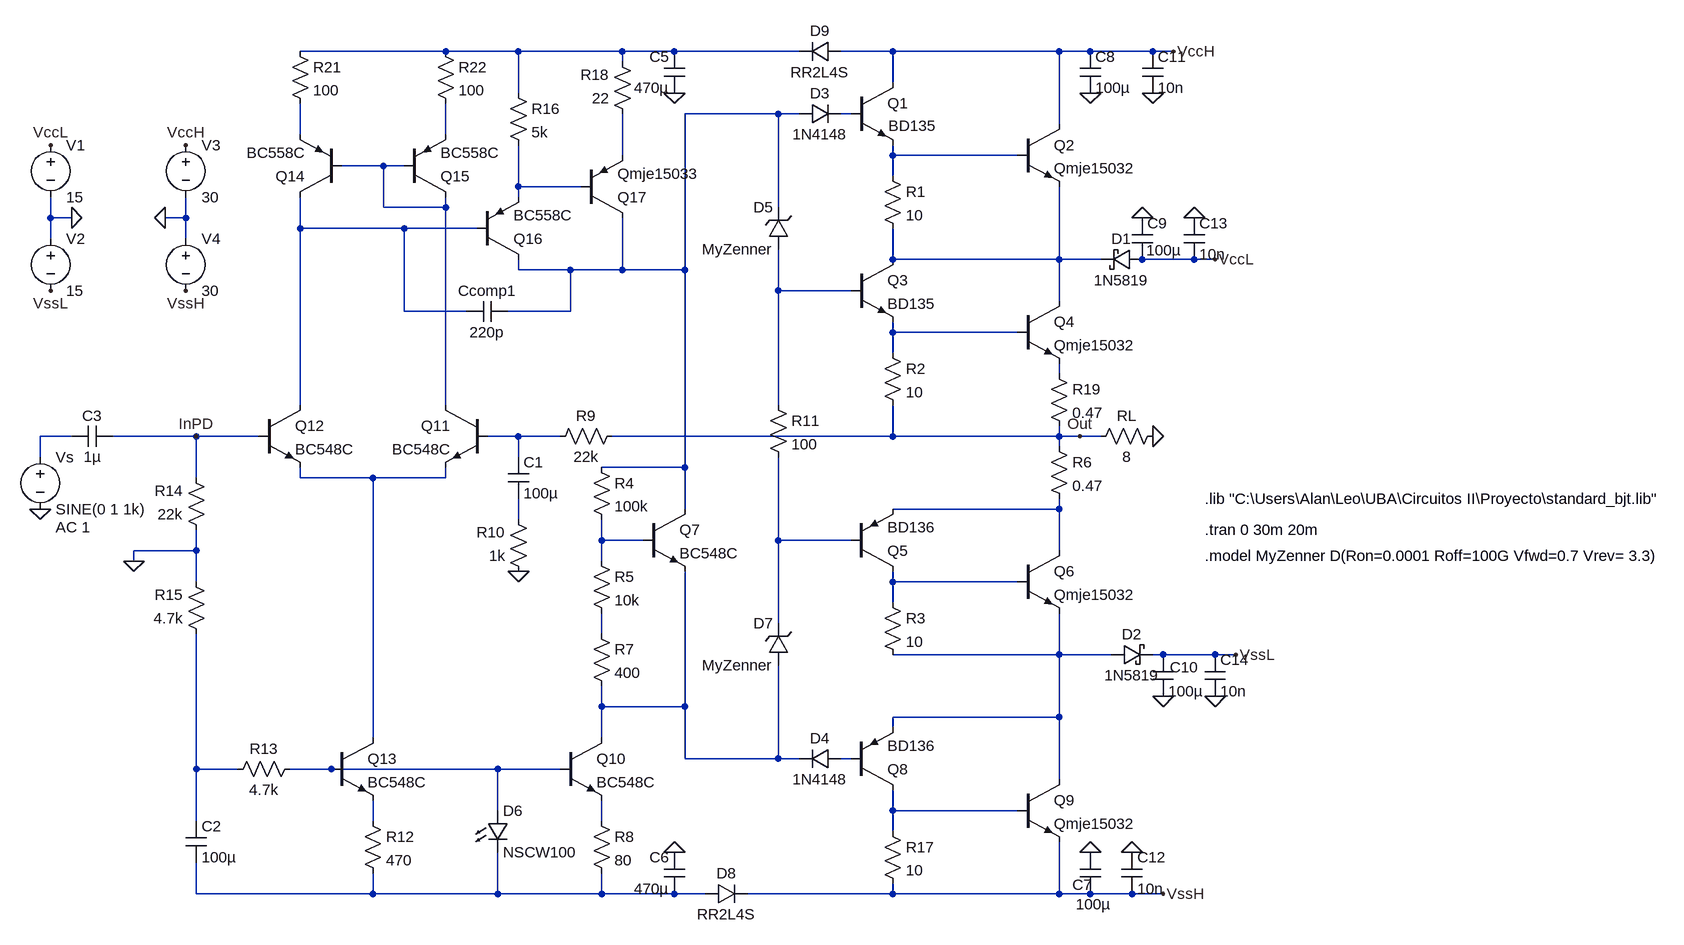
[diagram p0: schematic etapa_ampli_Sziklai (1).asc]
etapa_ampli_Sziklai (1).asc, the LTspice schematic file:
Version 4
SHEET 1 1736 1408
WIRE -512 48 -736 48
WIRE -400 48 -512 48
WIRE -240 48 -400 48
WIRE -160 48 -240 48
WIRE 32 48 -160 48
WIRE 176 48 96 48
WIRE 432 48 176 48
WIRE 480 48 432 48
WIRE 576 48 480 48
WIRE 608 48 576 48
WIRE -240 64 -240 48
WIRE 176 96 176 48
WIRE -400 112 -400 48
WIRE 0 144 -144 144
WIRE 32 144 0 144
WIRE 112 144 96 144
WIRE 432 160 432 48
WIRE -736 176 -736 128
WIRE -512 176 -512 128
WIRE -240 208 -240 144
WIRE 176 208 176 192
WIRE 368 208 176 208
WIRE -608 224 -672 224
WIRE -576 224 -608 224
WIRE 176 240 176 208
WIRE -400 256 -400 192
WIRE -304 256 -400 256
WIRE -400 272 -400 256
WIRE -608 288 -608 224
WIRE -512 288 -512 272
WIRE -512 288 -608 288
WIRE 0 288 0 144
WIRE -1120 304 -1120 272
WIRE -1088 304 -1120 304
WIRE -912 304 -912 272
WIRE -912 304 -944 304
WIRE -736 320 -736 272
WIRE -576 320 -736 320
WIRE -464 320 -576 320
WIRE -1120 336 -1120 304
WIRE -912 336 -912 304
WIRE 176 368 176 320
WIRE 432 368 432 256
WIRE 432 368 176 368
WIRE 496 368 432 368
WIRE 640 368 560 368
WIRE 672 368 640 368
WIRE -400 384 -400 368
WIRE -320 384 -400 384
WIRE -240 384 -240 304
WIRE -240 384 -320 384
WIRE -144 384 -144 144
WIRE -144 384 -240 384
WIRE 0 416 0 352
WIRE 112 416 0 416
WIRE 432 432 432 368
WIRE -576 448 -576 320
WIRE -480 448 -576 448
WIRE -320 448 -320 384
WIRE -320 448 -416 448
WIRE 176 480 176 464
WIRE 368 480 176 480
WIRE 176 512 176 480
WIRE 432 544 432 528
WIRE -736 592 -736 320
WIRE -512 592 -512 288
WIRE 0 592 0 416
WIRE -1088 640 -1136 640
WIRE -896 640 -1024 640
WIRE -800 640 -896 640
WIRE -400 640 -448 640
WIRE -336 640 -400 640
WIRE 176 640 176 592
WIRE 176 640 -256 640
WIRE 432 640 432 624
WIRE 432 640 176 640
WIRE 464 640 432 640
WIRE 496 640 464 640
WIRE 432 656 432 640
WIRE -1136 672 -1136 640
WIRE -400 672 -400 640
WIRE -144 688 -144 384
WIRE -144 688 -272 688
WIRE -896 704 -896 640
WIRE -736 704 -736 688
WIRE -624 704 -736 704
WIRE -512 704 -512 688
WIRE -512 704 -624 704
WIRE -144 752 -144 688
WIRE 432 752 432 736
WIRE 432 752 176 752
WIRE -400 768 -400 736
WIRE -272 800 -272 768
WIRE -208 800 -272 800
WIRE 0 800 0 672
WIRE 112 800 0 800
WIRE -896 816 -896 784
WIRE -896 816 -992 816
WIRE 432 816 432 752
WIRE -992 832 -992 816
WIRE -272 832 -272 800
WIRE -896 864 -896 816
WIRE 176 864 176 848
WIRE 368 864 176 864
WIRE 176 896 176 864
WIRE 0 928 0 800
WIRE -272 944 -272 912
WIRE 432 976 432 912
WIRE 432 976 176 976
WIRE 512 976 432 976
WIRE 592 976 576 976
WIRE 672 976 592 976
WIRE 704 976 672 976
WIRE -272 1056 -272 1024
WIRE -144 1056 -144 848
WIRE -144 1056 -272 1056
WIRE 432 1072 432 976
WIRE 432 1072 176 1072
WIRE 176 1088 176 1072
WIRE -624 1104 -624 704
WIRE -272 1104 -272 1056
WIRE -144 1136 -144 1056
WIRE 0 1136 0 992
WIRE 0 1136 -144 1136
WIRE 32 1136 0 1136
WIRE 112 1136 96 1136
WIRE -896 1152 -896 944
WIRE -832 1152 -896 1152
WIRE -688 1152 -752 1152
WIRE -432 1152 -688 1152
WIRE -336 1152 -432 1152
WIRE 432 1168 432 1072
WIRE -432 1216 -432 1152
WIRE 176 1216 176 1184
WIRE 368 1216 176 1216
WIRE -896 1232 -896 1152
WIRE -624 1232 -624 1200
WIRE -272 1232 -272 1200
WIRE 176 1248 176 1216
WIRE -896 1344 -896 1296
WIRE -624 1344 -624 1312
WIRE -624 1344 -896 1344
WIRE -432 1344 -432 1280
WIRE -432 1344 -624 1344
WIRE -272 1344 -272 1312
WIRE -272 1344 -432 1344
WIRE -160 1344 -272 1344
WIRE -112 1344 -160 1344
WIRE 176 1344 176 1328
WIRE 176 1344 -48 1344
WIRE 432 1344 432 1264
WIRE 432 1344 176 1344
WIRE 480 1344 432 1344
WIRE 544 1344 480 1344
WIRE 592 1344 544 1344
FLAG 672 368 VccL
FLAG 608 48 VccH
FLAG 576 640 0
FLAG 592 1344 VssH
FLAG -1088 304 0
FLAG -944 304 0
FLAG -912 192 VccH
FLAG -1120 192 VccL
FLAG -912 416 VssH
FLAG -1120 416 VssL
FLAG 464 640 Out
FLAG -400 848 0
FLAG -992 832 0
FLAG -1136 752 0
FLAG 704 976 VssL
FLAG -896 640 InPD
FLAG -160 112 0
FLAG -160 1280 0
FLAG 592 1040 0
FLAG 480 1280 0
FLAG 560 304 0
FLAG 480 112 0
FLAG 576 112 0
FLAG 544 1280 0
FLAG 640 304 0
FLAG 672 1040 0
DATAFLAG -144 736 "$-V(N025)"
SYMBOL npn 112 96 R0
WINDOW 3 57 66 Left 2
SYMATTR Value BD135
SYMATTR InstName Q1
SYMBOL npn 368 160 R0
SYMATTR InstName Q2
SYMATTR Value Qmje15032
SYMBOL npn 112 368 R0
SYMATTR InstName Q3
SYMATTR Value BD135
SYMBOL npn 368 432 R0
SYMATTR InstName Q4
SYMATTR Value Qmje15032
SYMBOL res 160 224 R0
SYMATTR InstName R1
SYMATTR Value 10
SYMBOL res 480 656 R270
WINDOW 0 32 56 VTop 2
WINDOW 3 0 56 VBottom 2
SYMATTR InstName RL
SYMATTR Value 8
SYMBOL pnp 112 848 M180
SYMATTR InstName Q5
SYMATTR Value BD136
SYMBOL pnp 112 1184 M180
SYMATTR InstName Q8
SYMATTR Value BD136
SYMBOL voltage -1120 176 R0
WINDOW 123 0 0 Left 0
WINDOW 39 0 0 Left 0
SYMATTR InstName V1
SYMATTR Value 15
SYMBOL voltage -1120 320 R0
WINDOW 123 0 0 Left 0
WINDOW 39 0 0 Left 0
SYMATTR InstName V2
SYMATTR Value 15
SYMBOL voltage -912 176 R0
WINDOW 123 0 0 Left 0
WINDOW 39 0 0 Left 0
SYMATTR InstName V3
SYMATTR Value 30
SYMBOL voltage -912 320 R0
WINDOW 123 0 0 Left 0
WINDOW 39 0 0 Left 0
SYMATTR InstName V4
SYMATTR Value 30
SYMBOL diode 32 160 R270
WINDOW 0 32 32 VTop 2
WINDOW 3 0 32 VBottom 2
SYMATTR InstName D3
SYMATTR Value 1N4148
SYMBOL diode 96 1120 R90
WINDOW 0 0 32 VBottom 2
WINDOW 3 32 32 VTop 2
SYMATTR InstName D4
SYMATTR Value 1N4148
SYMBOL res 160 496 R0
SYMATTR InstName R2
SYMATTR Value 10
SYMBOL npn -208 752 R0
SYMATTR InstName Q7
SYMATTR Value BC548C
SYMBOL res -288 672 R0
SYMATTR InstName R4
SYMATTR Value 100k
SYMBOL res -288 816 R0
SYMATTR InstName R5
SYMATTR Value 10k
SYMBOL npn -336 1104 R0
SYMATTR InstName Q10
SYMATTR Value BC548C
SYMBOL res -288 1216 R0
SYMATTR InstName R8
SYMATTR Value 80
SYMBOL npn -448 592 M0
SYMATTR InstName Q11
SYMATTR Value BC548C
SYMBOL res -240 624 R90
WINDOW 0 0 56 VBottom 2
WINDOW 3 32 56 VTop 2
SYMATTR InstName R9
SYMATTR Value 22k
SYMBOL res -384 864 R180
WINDOW 0 36 76 Left 2
WINDOW 3 36 40 Left 2
SYMATTR InstName R10
SYMATTR Value 1k
SYMBOL cap -416 672 R0
SYMATTR InstName C1
SYMATTR Value 100µ
SYMBOL res -16 576 R0
SYMATTR InstName R11
SYMATTR Value 100
SYMBOL npn -800 592 R0
SYMATTR InstName Q12
SYMATTR Value BC548C
SYMBOL npn -688 1104 R0
SYMATTR InstName Q13
SYMATTR Value BC548C
SYMBOL res -640 1216 R0
SYMATTR InstName R12
SYMATTR Value 470
SYMBOL res -736 1136 R90
WINDOW 0 0 56 VBottom 2
WINDOW 3 32 56 VTop 2
SYMATTR InstName R13
SYMATTR Value 4.7k
SYMBOL res -880 800 R180
WINDOW 0 36 76 Left 2
WINDOW 3 36 40 Left 2
SYMATTR InstName R14
SYMATTR Value 22k
SYMBOL res -880 960 R180
WINDOW 0 36 76 Left 2
WINDOW 3 36 40 Left 2
SYMATTR InstName R15
SYMATTR Value 4.7k
SYMBOL cap -912 1232 R0
SYMATTR InstName C2
SYMATTR Value 100µ
SYMBOL cap -1024 624 R90
WINDOW 0 0 32 VBottom 2
WINDOW 3 32 32 VTop 2
SYMATTR InstName C3
SYMATTR Value 1µ
SYMBOL voltage -1136 656 R0
WINDOW 123 24 124 Left 2
WINDOW 39 0 0 Left 0
SYMATTR Value2 AC 1
SYMATTR InstName Vs
SYMATTR Value SINE(0 1 1k)
SYMBOL pnp -672 272 R180
SYMATTR InstName Q14
SYMATTR Value BC558C
SYMBOL pnp -576 272 M180
SYMATTR InstName Q15
SYMATTR Value BC558C
SYMBOL res -416 96 R0
SYMATTR InstName R16
SYMATTR Value 5k
SYMBOL pnp -464 368 M180
SYMATTR InstName Q16
SYMATTR Value BC558C
SYMBOL res 416 528 R0
SYMATTR InstName R19
SYMATTR Value 0.47
SYMBOL zener 16 992 R180
WINDOW 0 24 64 Left 2
WINDOW 3 24 0 Left 2
SYMATTR InstName D7
SYMATTR Value MyZenner
SYMBOL zener 16 352 R180
WINDOW 0 24 64 Left 2
WINDOW 3 24 0 Left 2
SYMATTR InstName D5
SYMATTR Value MyZenner
SYMBOL schottky 560 352 R90
WINDOW 0 0 32 VBottom 2
WINDOW 3 32 32 VTop 2
SYMATTR InstName D1
SYMATTR Value 1N5819
SYMATTR Description Diode
SYMATTR Type diode
SYMBOL schottky 512 992 R270
WINDOW 0 32 32 VTop 2
WINDOW 3 0 32 VBottom 2
SYMATTR InstName D2
SYMATTR Value 1N5819
SYMATTR Description Diode
SYMATTR Type diode
SYMBOL LED -448 1216 R0
SYMATTR InstName D6
SYMATTR Value NSCW100
SYMBOL npn 368 816 R0
SYMATTR InstName Q6
SYMATTR Value Qmje15032
SYMBOL res 160 880 R0
SYMATTR InstName R3
SYMATTR Value 10
SYMBOL res 416 640 R0
SYMATTR InstName R6
SYMATTR Value 0.47
SYMBOL npn 368 1168 R0
SYMATTR InstName Q9
SYMATTR Value Qmje15032
SYMBOL res 160 1232 R0
SYMATTR InstName R17
SYMATTR Value 10
SYMBOL res -224 160 R180
WINDOW 0 36 76 Left 2
WINDOW 3 36 40 Left 2
SYMATTR InstName R18
SYMATTR Value 22
SYMBOL pnp -304 304 M180
SYMATTR InstName Q17
SYMATTR Value Qmje15033
SYMBOL cap -416 432 R90
WINDOW 0 0 32 VBottom 2
WINDOW 3 32 32 VTop 2
SYMATTR InstName Ccomp1
SYMATTR Value 220p
SYMBOL diode -112 1360 R270
WINDOW 0 32 32 VTop 2
WINDOW 3 0 32 VBottom 2
SYMATTR InstName D8
SYMATTR Value RR2L4S
SYMBOL diode 96 32 R90
WINDOW 0 0 32 VBottom 2
WINDOW 3 32 32 VTop 2
SYMATTR InstName D9
SYMATTR Value RR2L4S
SYMBOL cap -144 112 R180
WINDOW 0 24 56 Left 2
WINDOW 3 24 8 Left 2
SYMATTR InstName C5
SYMATTR Value 470µ
SYMBOL cap -144 1344 R180
WINDOW 0 24 56 Left 2
WINDOW 3 24 8 Left 2
SYMATTR InstName C6
SYMATTR Value 470µ
SYMBOL cap 464 1280 R0
WINDOW 0 -12 50 Left 2
WINDOW 3 -6 80 Left 2
SYMATTR InstName C7
SYMATTR Value 100µ
SYMBOL cap 464 48 R0
SYMATTR InstName C8
SYMATTR Value 100µ
SYMBOL cap 544 304 R0
WINDOW 3 22 50 Left 2
SYMATTR Value 100µ
SYMATTR InstName C9
SYMBOL cap 576 976 R0
WINDOW 0 26 19 Left 2
SYMATTR InstName C10
SYMATTR Value 100µ
SYMBOL res -752 32 R0
SYMATTR InstName R21
SYMATTR Value 100
SYMBOL res -528 32 R0
SYMATTR InstName R22
SYMATTR Value 100
SYMBOL cap 560 48 R0
SYMATTR InstName C11
SYMATTR Value 10n
SYMBOL cap 528 1280 R0
SYMATTR InstName C12
SYMATTR Value 10n
SYMBOL cap 624 304 R0
SYMATTR InstName C13
SYMATTR Value 10n
SYMBOL cap 656 976 R0
SYMATTR InstName C14
SYMATTR Value 10n
SYMBOL res -288 928 R0
SYMATTR InstName R7
SYMATTR Value 400
TEXT 656 736 Left 2 !.lib "C:\\Users\\Alan\\Leo\\UBA\\Circuitos II\\Proyecto\\standard_bjt.lib"
TEXT 656 784 Left 2 !.tran 0 30m 20m
TEXT 656 824 Left 2 !.model MyZenner D(Ron=0.0001 Roff=100G Vfwd=0.7 Vrev= 3.3)

The netlist it stands for:
* etapa_ampli_Sziklai (1).asc
Q1 VccH N003 N007 0 BD135
Q2 VccH N007 N011 0 Qmje15032
Q3 N011 N012 N013 0 BD135
Q4 N011 N013 N014 0 Qmje15032
R1 N007 N011 10
RL Out 0 8
Q5 N022 N021 N018 0 BD136
Q8 N029 N026 N024 0 BD136
V1 VccL 0 15
V2 0 VssL 15
V3 VccH 0 30
V4 0 VssH 30
D3 N002 N003 1N4148
D4 N026 N025 1N4148
R2 N013 Out 10
Q7 N002 N020 N025 0 BC548C
R4 N002 N020 100k
R5 N020 N023 10k
Q10 N025 N028 N031 0 BC548C
R8 N031 N032 80
Q11 N008 N016 N017 0 BC548C
R9 Out N016 22k
R10 0 N019 1k
C1 N016 N019 100µ
R11 N012 N021 100
Q12 N010 InPD N017 0 BC548C
Q13 N017 N028 N030 0 BC548C
R12 N030 N032 470
R13 N028 N027 4.7k
R14 0 InPD 22k
R15 N027 0 4.7k
C2 N027 N032 100µ
C3 InPD N015 1µ
Vs N015 0 SINE(0 1 1k) AC 1
Q14 N010 N008 N004 0 BC558C
Q15 N008 N008 N005 0 BC558C
R16 N001 N009 5k
Q16 N002 N010 N009 0 BC558C
R19 N014 Out 0.47
D7 N025 N021 MyZenner
D5 N012 N002 MyZenner
D1 VccL N011 1N5819
D2 N024 VssL 1N5819
D6 N028 N032 NSCW100
Q6 N018 N022 N024 0 Qmje15032
R3 N022 N024 10
R6 Out N018 0.47
Q9 N024 N029 VssH 0 Qmje15032
R17 N029 VssH 10
R18 N006 N001 22
Q17 N002 N009 N006 0 Qmje15033
Ccomp1 N002 N010 220p
D8 N032 VssH RR2L4S
D9 VccH N001 RR2L4S
C5 0 N001 470µ
C6 N032 0 470µ
C7 0 VssH 100µ
C8 VccH 0 100µ
C9 0 VccL 100µ
C10 VssL 0 100µ
R21 N001 N004 100
R22 N001 N005 100
C11 VccH 0 10n
C12 0 VssH 10n
C13 0 VccL 10n
C14 VssL 0 10n
R7 N023 N025 400
.model D D
.lib standard.dio
.model NPN NPN
.model PNP PNP
.lib standard.bjt
.lib "C:\Users\Alan\Leo\UBA\Circuitos II\Proyecto\standard_bjt.lib"
.tran 0 30m 20m
.model MyZenner D(Ron=0.0001 Roff=100G Vfwd=0.7 Vrev= 3.3)
.backanno
.end